# Altium project 2017_MADS.PrjPcb
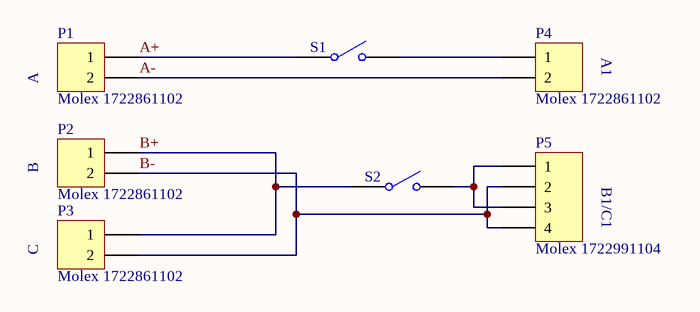
[diagram p0: 2017_MADS.SchDoc]
1 sheet, 7 parts. Net scope: global (net labels, ports and power ports of the same name join across sheets).
Board file: 2017_MADS.PcbDoc

## Sheet 2017_MADS.SchDoc
size Letter

### Parts
P1  Molex 1722861102  [Molex 1722861102]
P2  Molex 1722861102  [Molex 1722861102]
P3  Molex 1722861102  [Molex 1722861102]
P4  Molex 1722861102  [Molex 1722861102]
P5  Molex 1722991104  [Molex 1722991104]
S1  SW-SPST  [Screw Switch]  (value not drawn)
S2  SW-SPST  [Screw Switch]  (value not drawn)

### Nets
A+: P1.1 S1.1(COMMON)
A-: P1.2 P4.2
B+: P2.1 P3.1 S2.1(COMMON)
B-: P2.2 P3.2 P5.2 P5.4
NetP4_1: P4.1 S1.2(NO)
NetP5_1: P5.1 P5.3 S2.2(NO)

### Notes on the sheet
- A
- (near P4) A1
- B
- (near P5) B1/C1
- C

### Library data of the parts
P1-P4 = Molex 1722861102: ULTRAFIT CONN HDR 02CKT; Supplier 1: Digi-Key; Supplier Part Number 1: WM11570-ND
P5 = Molex 1722991104: ULTRAFIT VERT TIN PLATED BLK; Supplier 1: Digi-Key; Supplier Part Number 1: WM11777-ND
S1 S2 = SW-SPST: Single-Pole, Single-Throw Switch; Published: 24-Mar-1999; LatestRevisionDate: 17-Jul-2002; LatestRevisionNote: Re-released for DXP Platform.; PackageReference: SPST-2; Publisher: Altium Limited; PackageDescription: Switch; 2 Leads